# EAGLE schematic wifi_agronautes (EAGLE 6.1)
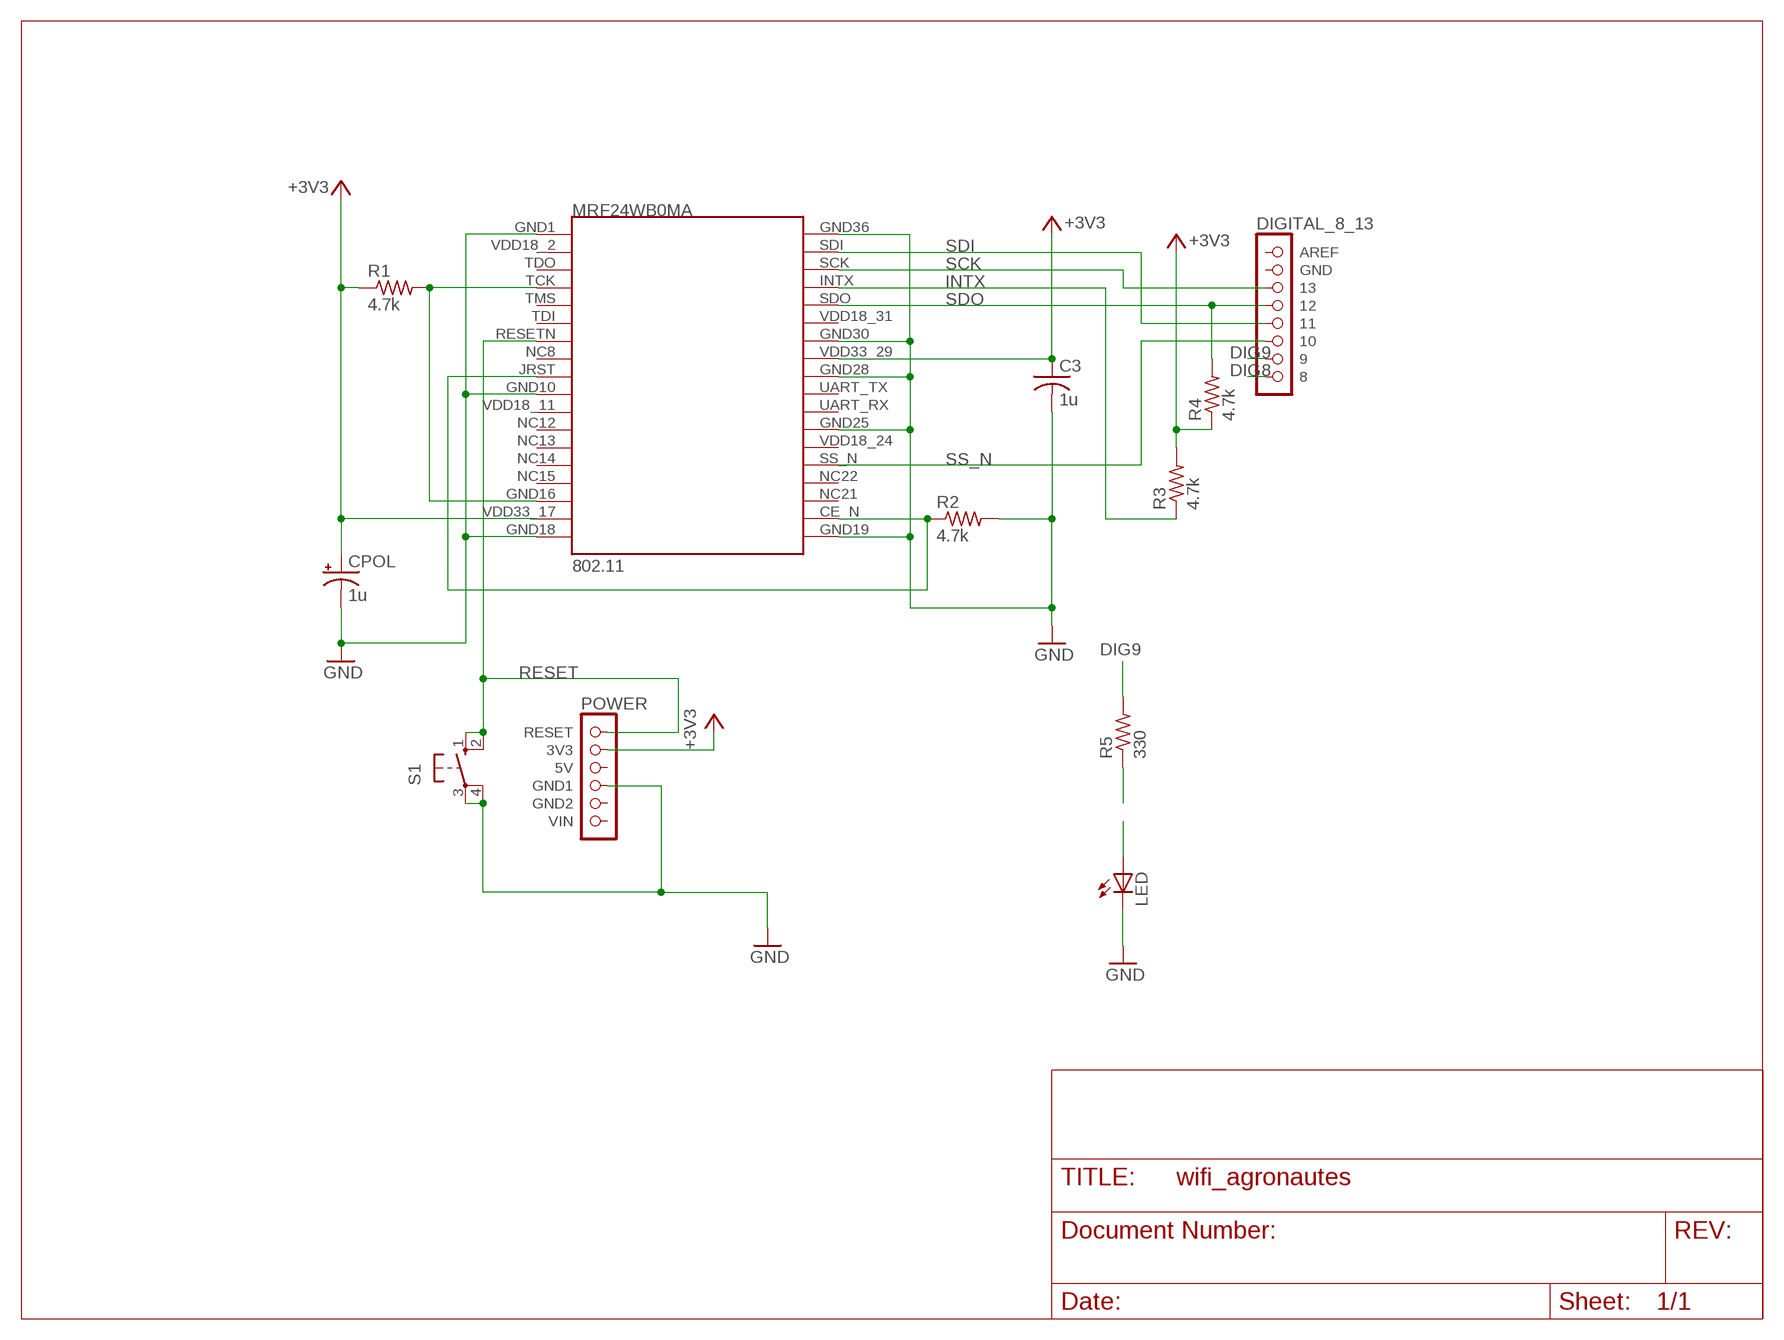
[diagram p0: schematic, sheet 1]

## Parts
C3  1u  CAP  [CAP]
CPOL  1u  PCAP  [PCAP]
LED  LED3MM  [LED3MM]
MRF24WB0MA  802.11  ZG2100MOD  [ZG2100MOD]
R1  4.7k  RES_SMALL  [RES_SMALL]
R2  4.7k  RES_SMALL  [RES_SMALL]
R3  4.7k  RES_SMALL  [RES_SMALL]
R4  4.7k  RES  [RES]
R5  330  RES_SMALL  [RES_SMALL]
S1  SWITCH  [SWITCH]
U$1  POWER  [1X06]
U$4  DIGITAL_8_13  [1X08]

## Nets
+3V3: C3.1 CPOL.+ MRF24WB0MA.VDD33_17 MRF24WB0MA.VDD33_29 R1.1 R3.2 R4.1 U$1.2(3V3)
DIG8: U$4.8
DIG9: R5.2 U$4.7
GND: C3.2 CPOL.- LED.K(C) MRF24WB0MA.GND1 MRF24WB0MA.GND10 MRF24WB0MA.GND18 MRF24WB0MA.GND19 MRF24WB0MA.GND25 MRF24WB0MA.GND28 MRF24WB0MA.GND30 MRF24WB0MA.GND36 R2.2 S1.3(P) S1.4(P1) U$1.4(GND1)
GND_TIE: MRF24WB0MA.CE_N MRF24WB0MA.JRST R2.1
INTX: MRF24WB0MA.INTX R3.1
N$1: R5.1
N$2: LED.A
RESET: MRF24WB0MA.RESETN(RSTN) S1.1(S) S1.2(S1) U$1.1(RESET)
SCK: MRF24WB0MA.SCK U$4.3
SDI: MRF24WB0MA.SDI U$4.5
SDO: MRF24WB0MA.SDO R4.2 U$4.4
SS_N: MRF24WB0MA.SS_N U$4.6
VDD_TIE: MRF24WB0MA.GND16 MRF24WB0MA.TCK R1.2
Unconnected: MRF24WB0MA.NC8 MRF24WB0MA.NC12 MRF24WB0MA.NC13 MRF24WB0MA.NC14 MRF24WB0MA.NC15 MRF24WB0MA.NC21 MRF24WB0MA.NC22 MRF24WB0MA.TDI MRF24WB0MA.TDO MRF24WB0MA.TMS MRF24WB0MA.UART_RX MRF24WB0MA.UART_TX MRF24WB0MA.VDD18_2 MRF24WB0MA.VDD18_11 MRF24WB0MA.VDD18_24 MRF24WB0MA.VDD18_31 U$1.3(5V) U$1.5(GND2) U$1.6(VIN) U$4.1(AREF) U$4.2(GND)

## Library data of the parts
C3 = ZGLIB:CAP
CPOL = ZGLIB:PCAP
LED = led:LED: LED OSRAM: - CHIPLED LG R971, LG N971, LY N971, LG Q971, LY Q971, LO R971, LY R971 LH N974, LH R974 LS Q976, LO Q976, LY Q976 LO Q996 - Hyper CHIPLED LW Q18S LB Q993, LB Q99A, LB R99A - SideLED LS A670, LO A670, LY A670, LG A670, LP A670 LB A673, LV A673, LT A673, LW A673 LH A674 LY A675 LS A676, LA A676, LO A676, LY A676, LW A676 LS A679, LY A679, LG A679 - Hyper Micro SIDELED® LS Y876, LA Y876, LO Y876, LY Y876 LT Y87S - SmartLED LW L88C, LW L88S LB L89C, LB L89S, LG L890 LS L89K, LO L89K, LY L89K LS L896, LA L896, LO L896, LY L896 - TOPLED LS T670, LO T670, LY T670, LG T670, LP T670 LSG T670, LSP T670, LSY T670, LOP T670, LYG T670 LG T671, LOG T671, LSG T671 LB T673, LV T673, LT T673, LW T673 LH T674 LS T676, LA T676, LO T676, LY T676, LB T676, LH T676, LSB T676, LW T676 LB T67C, LV T67C, LT T67C, LS T67K, LO T67K, LY T67K, LW E67C LS E67B, LA E67B, LO E67B, LY E67B, LB E67C, LV E67C, LT E67C LW T67C LS T679, LY T679, LG T679 LS T770, LO T770, LY T770, LG T770, LP T770 LB T773, LV T773, LT T773, LW T773 LH T774 LS E675, LA E675, LY E675, LS T675 LS T776, LA T776, LO T776, LY T776, LB T776 LHGB T686 LT T68C, LB T68C - Hyper Mini TOPLED® LB M676 - Mini TOPLED Santana® LG M470 LS M47K, LO M47K, LY M47K Source: http://www.osram.convergy.de LUXEON: - LUMILED® LXK2-PW12-R00, LXK2-PW12-S00, LXK2-PW14-U00, LXK2-PW14-V00 LXK2-PM12-R00, LXK2-PM12-S00, LXK2-PM14-U00 LXK2-PE12-Q00, LXK2-PE12-R00, LXK2-PE12-S00, LXK2-PE14-T00, LXK2-PE14-U00 LXK2-PB12-K00, LXK2-PB12-L00, LXK2-PB12-M00, LXK2-PB14-N00, LXK2-PB14-P00, LXK2-PB14-Q00 LXK2-PR12-L00, LXK2-PR12-M00, LXK2-PR14-Q00, LXK2-PR14-R00 LXK2-PD12-Q00, LXK2-PD12-R00, LXK2-PD12-S00 LXK2-PH12-R00, LXK2-PH12-S00 LXK2-PL12-P00, LXK2-PL12-Q00, LXK2-PL12-R00 Source: www.luxeon.com KINGBRIGHT: KA-3528ASYC Source: www.kingbright.com
MRF24WB0MA = ZGLIB:ZG2100MOD: ZG2100 Module
R1-R3 R5 = ZGLIB:RES_SMALL
R4 = ZGLIB:RES
S1 = ZGLIB:SWITCH
U$1 = arduino:POWER
U$4 = arduino:DIGITAL_8_13